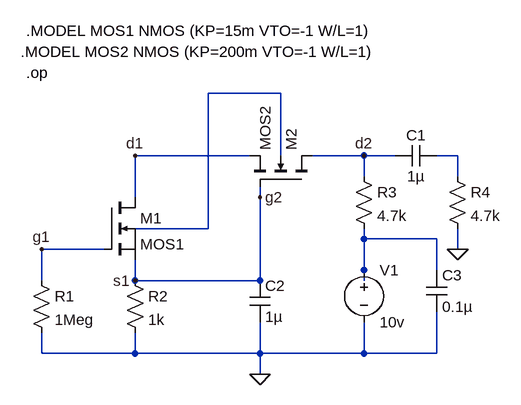
[diagram p0: schematic simulacion.asc]
simulacion.asc, the LTspice schematic file:
Version 4
SHEET 1 880 680
WIRE 224 0 112 0
WIRE 176 96 0 96
WIRE 224 96 224 0
WIRE 352 96 272 96
WIRE 400 96 352 96
WIRE 496 96 464 96
WIRE 352 128 352 96
WIRE 496 128 496 96
WIRE 0 160 0 96
WIRE 192 160 192 144
WIRE 112 208 112 0
WIRE 112 208 0 208
WIRE 352 224 352 208
WIRE 464 224 352 224
WIRE -48 240 -144 240
WIRE 496 240 496 208
WIRE 352 272 352 224
WIRE 464 272 464 224
WIRE -144 288 -144 240
WIRE 0 288 0 256
WIRE 192 288 192 160
WIRE 192 288 0 288
WIRE 352 288 352 272
WIRE -144 400 -144 368
WIRE 0 400 0 368
WIRE 0 400 -144 400
WIRE 192 400 192 352
WIRE 192 400 0 400
WIRE 352 400 352 352
WIRE 352 400 192 400
WIRE 464 400 464 336
WIRE 464 400 352 400
WIRE 192 432 192 400
FLAG 496 240 0
FLAG 192 432 0
FLAG 0 96 d1
FLAG 192 160 g2
FLAG -144 240 g1
FLAG 0 288 s1
FLAG 352 96 d2
SYMBOL nmos4 272 144 M270
SYMATTR InstName M2
SYMATTR Value MOS2
SYMBOL nmos -48 160 R0
SYMATTR InstName M1
SYMATTR Value MOS1
SYMBOL res -160 272 R0
SYMATTR InstName R1
SYMATTR Value 1Meg
SYMBOL res -16 272 R0
SYMATTR InstName R2
SYMATTR Value 1k
SYMBOL res 336 112 R0
SYMATTR InstName R3
SYMATTR Value 4.7k
SYMBOL res 480 112 R0
SYMATTR InstName R4
SYMATTR Value 4.7k
SYMBOL cap 400 112 R270
WINDOW 0 32 32 VTop 2
WINDOW 3 0 32 VBottom 2
SYMATTR InstName C1
SYMATTR Value 1µ
SYMBOL cap 176 288 R0
SYMATTR InstName C2
SYMATTR Value 1µ
SYMBOL voltage 352 256 R0
SYMATTR InstName V1
SYMATTR Value 10v
SYMBOL cap 448 272 R0
SYMATTR InstName C3
SYMATTR Value 0.1µ
TEXT -168 -96 Left 2 !.MODEL MOS1 NMOS (KP=15m VTO=-1 W/L=1)
TEXT -176 -64 Left 2 !.MODEL MOS2 NMOS (KP=200m VTO=-1 W/L=1)
TEXT -168 -32 Left 2 !.op

The netlist it stands for:
* simulacion.asc
M2 d2 s1 d1 N001 MOS2
M1 d1 g1 s1 s1 MOS1
R1 g1 0 1Meg
R2 s1 0 1k
R3 d2 N003 4.7k
R4 N002 0 4.7k
C1 d2 N002 1µ
C2 s1 0 1µ
V1 N003 0 10v
C3 N003 0 0.1µ
.model NMOS NMOS
.model PMOS PMOS
.lib standard.mos
.MODEL MOS1 NMOS (KP=15m VTO=-1 W/L=1)
.MODEL MOS2 NMOS (KP=200m VTO=-1 W/L=1)
.op
.backanno
.end